# Altium schematic sheet IO.SchDoc: USB, microSD Card & Sensor Interface
size A4; DrawnBy: A. Küllenberg; Revision: A; SheetNumber: 10; SheetTotal: 10
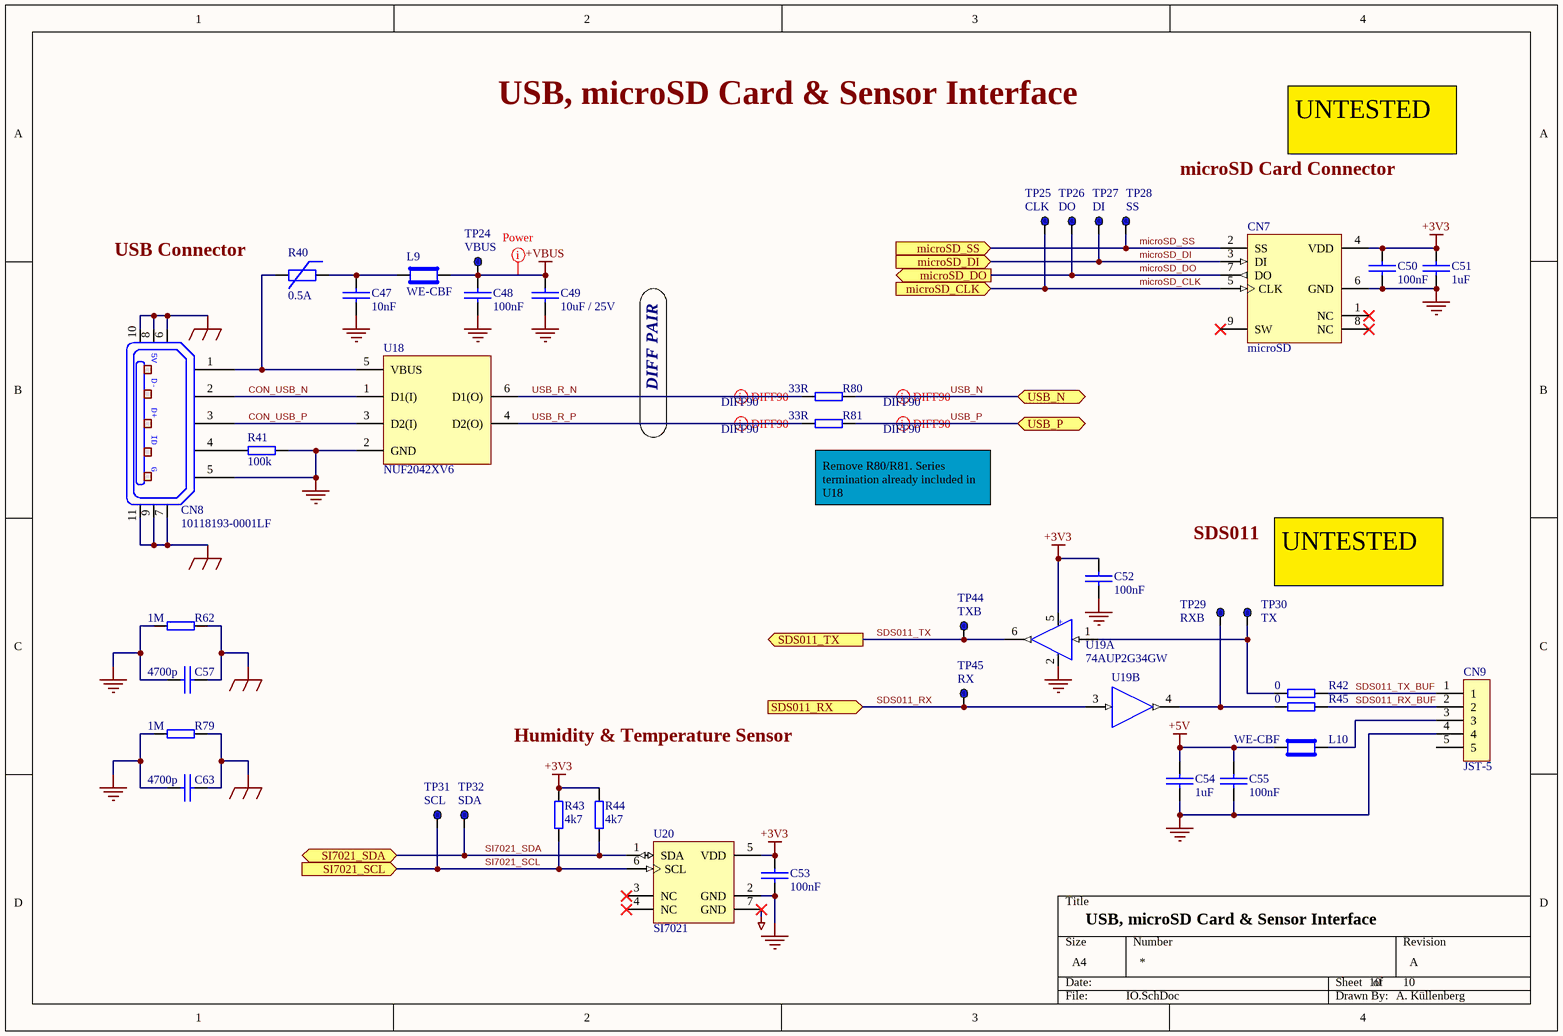
[diagram p0: IO.SchDoc]

## Parts
C47  10nF  [C0603]
C48  100nF  [C0603]
C49  10uF / 25V  [C0603]
C50  100nF  [C0603]
C51  1uF  [C0603]
C52  100nF  [C0603]
C53  100nF  [C0603]
C54  1uF  [C0603]
C55  100nF  [C0603]
C57  4700p  [C0805]
C63  4700p  [C0805]
CN7  microSD  [1050270001]
CN8  10118193-0001LF  [10118193]
CN9  JST-5  [JST-5]
L9  WE-CBF  [L0603]
L10  WE-CBF  [L0603]
R40  0.5A  [PTC-0603]
R41  100k  [R0603]
R42  0  [R0603]
R43  4k7  [R0603]
R44  4k7  [R0603]
R45  0  [R0603]
R62  1M  [R0805]
R79  1M  [R0805]
R80  33R  [R0402]
R81  33R  [R0402]
TP24  VBUS  [TP_1mm]  (no BOM)
TP25  CLK  [TP_1mm]  (no BOM)
TP26  DO  [TP_1mm]  (no BOM)
TP27  DI  [TP_1mm]  (no BOM)
TP28  SS  [TP_1mm]  (no BOM)
TP29  RXB  [TP_1mm]  (no BOM)
TP30  TX  [TP_1mm]  (no BOM)
TP31  SCL  [TP_1mm]  (no BOM)
TP32  SDA  [TP_1mm]  (no BOM)
TP44  TXB  [TP_1mm]  (no BOM)
TP45  RX  [TP_1mm]  (no BOM)
U18  NUF2042XV6  [SOT-563]
U19  74AUP2G34GW  [SOT363]  (parts A,B of 2)
U20  SI7021  [SI7021]

## Ports
microSD_CLK (in), microSD_DI (in), microSD_DO (out), microSD_SS (in), SDS011_RX (in), SDS011_TX (out), SI7021_SCL (in), SI7021_SDA (bidir), USB_N (bidir), USB_P (bidir)

## Nets
+3V3: C50.2 C51.2 C52.2 C53.2 CN7.4(VDD) R43.2 R44.2 U19.5 U20.5(VDD)
+5V: C54.1 C55.1 L10.1
+VBUS: C48.2 C49.2 L9.2 TP24.1
GND: C47.1 C48.1 C49.1 C50.1 C51.1 C52.1 C53.1 C54.2 C55.2 C57.1 C63.1 CN7.6(GND) CN8.5 CN9.4 R41.2 R62.1 R79.1 U18.2(GND) U19.2 U20.2(GND)
SHIELD: C57.2 C63.2 CN8.6 CN8.7 CN8.8 CN8.9 CN8.10 CN8.11 R62.2 R79.2
TH1: U20.7(GND)
CON_USB_N: CN8.2 U18.1(D1(I))
CON_USB_P: CN8.3 U18.3(D2(I))
microSD_CLK: CN7.5(CLK) TP25.1 ; port microSD_CLK
microSD_DI: CN7.3(DI) TP27.1 ; port microSD_DI
microSD_DO: CN7.7(DO) TP26.1 ; port microSD_DO
microSD_SS: CN7.2(SS) TP28.1 ; port microSD_SS
SDS011_RX: TP45.1 U19.3 ; port SDS011_RX
SDS011_RX_BUF: CN9.2 R45.2
SDS011_TX: TP44.1 U19.6 ; port SDS011_TX
SDS011_TX_BUF: CN9.1 R42.2
SI7021_SCL: R43.1 TP31.1 U20.6(SCL) ; port SI7021_SCL
SI7021_SDA: R44.1 TP32.1 U20.1(SDA) ; port SI7021_SDA
USB_N: R80.2 ; port USB_N
USB_P: R81.2 ; port USB_P
USB_R_N: R80.1 U18.6(D1(O))
USB_R_P: R81.1 U18.4(D2(O))
NetC47_2: C47.2 L9.1 R40.1
NetCN8_1: CN8.1 R40.2 U18.5(VBUS)
NetCN8_4: CN8.4 R41.1
NetCN9_3: CN9.3 L10.2
NetR42_1: R42.1 TP30.1 U19.1
NetR45_1: R45.1 TP29.1 U19.4

Not connected (* = marked no-connect by the designer): CN7 1(NC)* 8(NC)* 9(SW)*; CN9 5; U20 3(NC)* 4(NC)*

## Layout directives
differential pair; net class DIFF90: USB_N, USB_P, USB_R_N, USB_R_P
net class Power: +VBUS

## Notes on the sheet
- USB, microSD Card & Sensor Interface
- microSD Card Connector
- UNTESTED
- (near R40) USB Connector
- DIFF PAIR
- (near R81) Remove R80/R81. Series termination already included in U18
- SDS011
- Humidity & Temperature Sensor
- (in symbol 74AUP2G34GW,125, part A) +; -
- (in symbol 10118193-0001LF) 5V; D-; D+; ID; G

## Library data of the parts
C47 = 06035C103KAT2A: CAP CER 10000PF 50V X7R 0603; Manufacturer: AVX Corporation; Tolerance: ±10%; Part Number: 06035C103KAT2A; Value: 10nF; Supplier 1: Digi-Key; Supplier Part Number 1: 478-1227-1-ND; Manufacturer Part Number: 06035C103KAT2A; RoHS: RoHS Compliant; Category: Capacitors; Stock 1: 1245318; Pricing 1: 1=0.09, 10=0.017, 100=0.0079, 250=0.00644, 500=0.00552, 1000=0.0043 (EUR); Packaging: Cut Tape (CT); Capacitance: 10000pF; Voltage - Rated: 50V; Temperature Coefficient: X7R; Mounting Type: Surface Mount, MLCC; Operating Temperature: -55°C ~ 125°C; Applications: General Purpose; Ratings: -; Package / Case: 0603 (1608 Metric); Size / Dimension: 0.063" L x 0.032" W (1.60mm x 0.81mm); Height - Seated (Max): -; Thickness (Max): 0.035" (0.90mm); Lead Spacing: -; Features: -; Lead Style: -; ComponentLink1URL: http://datasheets.avx.com/X7RDielectric.pdf; ComponentLink1Description: http://datasheets.avx.com/X7RDielectric.pdf
C48 C50 C52 C53 C55 = C0603C104K5RACTU: CAP CER 0.1UF 50V X7R 0603; Manufacturer: Kemet; Capacitance: 0.10µF; Tolerance: ±10%; Part Number: C0603C104K5RACTU; Value: 100nF; Supplier 1: Digi-Key; Supplier Part Number 1: 399-5089-1-ND; Manufacturer Part Number: C0603C104K5RACTU; RoHS: RoHS Compliant; Category: Capacitors; Stock 1: 1628757; Pricing 1: 1=0.09, 10=0.037, 50=0.0198, 100=0.0167, 250=0.01372, 500=0.01174, 1000=0.00914 (EUR); Packaging: Cut Tape (CT); Voltage - Rated: 50V; Temperature Coefficient: X7R; Mounting Type: Surface Mount, MLCC; Operating Temperature: -55°C ~ 125°C; Applications: General Purpose; Ratings: -; Package / Case: 0603 (1608 Metric); Size / Dimension: 0.063" L x 0.031" W (1.60mm x 0.80mm); Height - Seated (Max): -; Thickness (Max): 0.034" (0.87mm); Lead Spacing: -; Features: -; Lead Style: -; ComponentLink1URL: http://www.kemet.com/docfinder?Partnumber=C0603C104K5RACTU; ComponentLink1Description: http://www.kemet.com/docfinder?Partnumber=C0603C104K5RACTU
C49 = ZRB18AR61E106ME01L: CAP CER 10UF 25V X5R 0603; Manufacturer: Murata Electronics North America; Capacitance: 10µF; Tolerance: ±20%; Part Number: ZRB18AR61E106ME01L; Value: 10uF / 25V; Supplier 1: Digi-Key; Supplier Part Number 1: 490-10991-1-ND; Manufacturer Part Number: ZRB18AR61E106ME01L; RoHS: RoHS Compliant; Category: Capacitors; Stock 1: 23575; Pricing 1: 1=0.4, 10=0.278, 25=0.2284, 50=0.195, 100=0.1671, 250=0.13924, 500=0.12532, 1000=0.10583 (EUR); Packaging: Cut Tape (CT); Voltage - Rated: 25V; Temperature Coefficient: X5R; Mounting Type: Surface Mount, MLCC; Operating Temperature: -55°C ~ 85°C; Applications: Acoustic Noise Reduction; Ratings: -; Package / Case: 0603 (1608 Metric); Size / Dimension: 0.063" L x 0.031" W (1.60mm x 0.80mm); Height - Seated (Max): -; Thickness (Max): 0.047" (1.20mm); Lead Spacing: -; Features: Interposer Termination; Lead Style: -; ComponentLink1URL: http://search.murata.co.jp/Ceramy/image/img/A01X/G101/ENG/ZRB18AR61E106ME01-01.pdf; ComponentLink1Description: http://search.murata.co.jp/Ceramy/image/img/A01X/G101/ENG/ZRB18AR61E106ME01-01.pdf; Part Status: Active
C51 C54 = GCM188R71E105KA64D: CAP CER 1UF 25V X7R 0603; Manufacturer: Murata Electronics North America; Capacitance: 1µF; Tolerance: ±10%; Part Number: GCM188R71E105KA64D; Value: 1uF; Supplier 1: Digi-Key; Supplier Part Number 1: 490-10673-1-ND; Manufacturer Part Number: GCM188R71E105KA64D; RoHS: RoHS Compliant; Category: Capacitors; Stock 1: 53908; Pricing 1: 1=0.19, 10=0.13, 50=0.0748, 100=0.0617, 250=0.05196, 500=0.04352, 1000=0.03572 (EUR); Packaging: Cut Tape (CT); Voltage - Rated: 25V; Temperature Coefficient: X7R; Mounting Type: Surface Mount, MLCC; Operating Temperature: -55°C ~ 125°C; Applications: Automotive; Ratings: AEC-Q200; Package / Case: 0603 (1608 Metric); Size / Dimension: 0.063" L x 0.031" W (1.60mm x 0.80mm); Height - Seated (Max): -; Thickness (Max): 0.035" (0.90mm); Lead Spacing: -; Features: -; Lead Style: -; ComponentLink1URL: http://www.murata.com/~/media/webrenewal/support/library/catalog/products/capacitor/mlcc/c03e.ashx; ComponentLink1Description: http://www.murata.com/~/media/webrenewal/support/library/catalog/products/capacitor/mlcc/c03e.ashx
C57 C63 = C0805V472KDRACTU: CAP CER 4700PF 1KV X7R 0805; Manufacturer: KEMET; Tolerance: ±10%; Voltage - Rated: 1000V (1kV); Part Number: C0805V472KDRACTU; Value: 4700p; Supplier 1: Digi-Key; Supplier Part Number 1: 399-6470-1-ND; Manufacturer Part Number: C0805V472KDRACTU; RoHS: RoHS Compliant; Category: Capacitors; Stock 1: 26470; Pricing 1: 1=0.21, 10=0.147, 100=0.0833, 500=0.0588, 1000=0.05145 (EUR); Packaging: Cut Tape (CT); Capacitance: 4700pF; Temperature Coefficient: X7R; Mounting Type: Surface Mount, MLCC; Operating Temperature: -55°C ~ 125°C; Applications: General Purpose; Ratings: -; Package / Case: 0805 (2012 Metric); Size / Dimension: 0.079" L x 0.049" W (2.00mm x 1.25mm); Height - Seated (Max): -; Thickness (Max): 0.055" (1.40mm); Lead Spacing: -; Features: High Voltage; Lead Style: -; ComponentLink1URL: http://www.kemet.com/docfinder?Partnumber=C0805V472KDRACTU; ComponentLink1Description: http://www.kemet.com/docfinder?Partnumber=C0805V472KDRACTU; Part Status: Active; Failure Rate: -
CN7 = 1050270001: CONN MICRO SD CARD PUSH-PULL R/A; Manufacturer: Molex, LLC; Connector Type: Connector; Number of Positions: 9 (8 + 1); Card Type: Secure Digital - microSD™; Insertion, Removal Method: Push In, Pull Out; Part Number: 1050270001; Value: microSD; Supplier 1: Digi-Key; Supplier Part Number 1: WM6825CT-ND; Manufacturer Part Number: 1050270001; RoHS: RoHS Compliant; Category: Connectors, Interconnects; Stock 1: 3139; Pricing 1: 1=1.38, 10=1.213, 25=1.1416, 50=1.094, 100=1.0465, 250=0.95136, 500=0.8562, 1000=0.76108 (EUR); Packaging: Cut Tape (CT); Mounting Type: Surface Mount, Right Angle; Features: Switch; Contact Finish: Gold; Contact Finish Thickness: Flash; ComponentLink1URL: http://www.molex.com/pdm_docs/sd/1050270001_sd.pdf; ComponentLink1Description: http://www.molex.com/pdm_docs/sd/1050270001_sd.pdf; Part Status: Active; Mounting Feature: Normal, Standard - Top; Ejector Side: -; Height Above Board: 0.067" (1.70mm)
CN8 = 10118193-0001LF: CONN USB MICRO B RECPT SMT R/A; Manufacturer: Amphenol FCI; Connector Type: USB - micro B; Number of Contacts: 5; Gender: Receptacle; Specifications: USB 2.0; Supplier 1: Digi-Key; Manufacturer Part Number: 10118193-0001LF; RoHS: RoHS Compliant; Category: Connectors, Interconnects; Stock 1: 3068; Pricing 1: 1=0.41, 10=0.393, 25=0.3372, 50=0.2862, 100=0.2751, 250=0.24704, 500=0.23582 (EUR); Packaging: Cut Tape (CT); Part Status: Active; Mounting Type: Surface Mount, Right Angle, Horizontal; Features: Shielded, Solder Retention; Ingress Protection: -; ComponentLink1URL: http://portal.fciconnect.com/Comergent//fci/drawing/10118193.pdf; ComponentLink1Description: http://portal.fciconnect.com/Comergent//fci/drawing/10118193.pdf; Supplier Part Number 1: 609-4616-1-ND
CN9 = B5B-XH-A(LF)(SN): CONN HEADER XH TOP 5POS 2.5MM; Manufacturer: JST Sales America Inc.; Number of Positions: 5; Number of Positions Loaded: All; Current Rating: 3A; Voltage Rating: 250V; Pitch - Mating: 0.098" (2.50mm); Shrouding: Shrouded - 4 Wall; Style: Board to Cable/Wire; Contact Length - Post: 0.134" (3.40mm); Material Flammability Rating: UL94 V-0; Mated Stacking Heights: 9.8mm; Part Number: B5B-XH-A(LF)(SN); Value: JST-5; Supplier 1: Digi-Key; Supplier Part Number 1: 455-2270-ND; Manufacturer Part Number: B5B-XH-A(LF)(SN); RoHS: RoHS Compliant; Category: Connectors, Interconnects; Stock 1: 53798; Pricing 1: 1=0.24, 10=0.224, 100=0.1552, 500=0.13134, 1000=0.10746, 5000=0.09552, 10000=0.08657 (EUR); Packaging: Bulk; Connector Type: Header; Contact Type: Male Pin; Number of Rows: 1; Mounting Type: Through Hole; Termination: Press-Fit, Solder; Fastening Type: Detent Lock; Features: -; ComponentLink1URL: http://www.jst-mfg.com/product/pdf/eng/eXH.pdf; ComponentLink1Description: http://www.jst-mfg.com/product/pdf/eng/eXH.pdf; Contact Material: Brass; Operating Temperature: -25°C ~ 85°C; Part Status: Active; Row Spacing - Mating: -; Contact Length - Mating: -; Contact Finish - Mating: Tin; Contact Finish Thickness - Mating: -; Insulation Color: Natural; Overall Contact Length: -; Insulation Height: 0.276" (7.00mm); Contact Shape: Square; Ingress Protection: -; Contact Finish - Post: Tin; Insulation Material: Polyamide (PA66), Nylon 6/6; Contact Finish Thickness - Post: -; Applications: -
L9 L10 = 742792651: FERRITE BEAD 600 OHM 0603 1LN; Manufacturer: Wurth Electronics Inc.; Filter Type: Signal Line; Number of Lines: 1; Impedance @ Frequency: 600 Ohm @ 100MHz; Current Rating (Max): 1A; DC Resistance (DCR) (Max): 200 mOhm; Part Number: 742792651; Value: WE-CBF; Supplier 1: Digi-Key; Supplier Part Number 1: 732-1593-1-ND; Manufacturer Part Number: 742792651; RoHS: RoHS Compliant; Category: Filters; Stock 1: 99870; Pricing 1: 1=0.22, 10=0.185, 50=0.1806, 100=0.1667, 1000=0.15164 (EUR); Packaging: Cut Tape (CT); Part Status: Active; Ratings: -; Operating Temperature: -55°C ~ 125°C; Package / Case: 0603 (1608 Metric); Mounting Type: Surface Mount; Height (Max): 0.039" (1.00mm); Size / Dimension: 0.063" L x 0.031" W (1.60mm x 0.80mm); ComponentLink1URL: http://katalog.we-online.de/pbs/datasheet/742792651.pdf; ComponentLink1Description: http://katalog.we-online.de/pbs/datasheet/742792651.pdf
R40 = MF-FSMF050X-2: FUSE PTC RESET 500MA SMD 0603; Manufacturer: Bourns Inc.; Voltage - Max: 6V; Current - Max: 40A; Time to Trip: 100ms; Resistance - Initial (Ri) (Min): 100 mOhm; Resistance - Post Trip (R1) (Max): 800 mOhm; Approvals: cURus, TUV; Part Number: MF-FSMF050X-2; Value: 0.5A; Supplier 1: Digi-Key; Supplier Part Number 1: MF-FSMF050X-2CT-ND; Manufacturer Part Number: MF-FSMF050X-2; RoHS: RoHS Compliant; Category: Circuit Protection; Stock 1: 19345; Pricing 1: 1=0.4, 5=0.394, 10=0.382, 50=0.321, 100=0.2666, 250=0.24232, 500=0.20598, 1000=0.18174 (EUR); Packaging: Cut Tape (CT); Mounting Type: Surface Mount; Package / Case: 0603 (1608 Metric), Concave; ComponentLink1URL: http://www.bourns.com/docs/Product-Datasheets/mffsmf.pdf; ComponentLink1Description: http://www.bourns.com/docs/Product-Datasheets/mffsmf.pdf; Part Status: Active; Operating Temperature: -40°C ~ 85°C; Type: Polymeric; Size / Dimension: 0.065" L x 0.033" W (1.65mm x 0.85mm); Height - Seated (Max): -; Thickness (Max): 0.039" (1.00mm); Lead Spacing: -; Resistance - 25°C (Typ): -; Ratings: -
R41 = RC0603FR-07100KL: RES SMD 100K OHM 1% 1/10W 0603; Manufacturer: Yageo; Power (Watts): 0.1W, 1/10W; Temperature Coefficient: ±100ppm/°C; Part Number: RC0603FR-07100KL; Value: 100k; Manufacturer Part Number: RC0603FR-07100KL; RoHS: RoHS Compliant; Category: Resistors; Stock 1: 6595647; Pricing 1: 1=0.09, 10=0.012, 25=0.0088, 50=0.007, 100=0.0051, 250=0.00388, 500=0.0031, 1000=0.00229 (EUR); Packaging: Cut Tape (CT); Resistance (Ohms): 100k; Tolerance: ±1%; Composition: Thick Film; Features: Moisture Resistant; Operating Temperature: -55°C ~ 155°C; Package / Case: 0603 (1608 Metric); Supplier Device Package: 0603; Size / Dimension: 0.063" L x 0.031" W (1.60mm x 0.80mm); ComponentLink1URL: http://www.yageo.com/documents/recent/PYu-RC_Group_51_RoHS_L_7.pdf; ComponentLink1Description: http://www.yageo.com/documents/recent/PYu-RC_Group_51_RoHS_L_7.pdf; Supplier 1: Digi-Key; Supplier Part Number 1: 311-100KHRCT-ND; Height - Seated (Max): 0.022" (0.55mm); Part Status: Active; Failure Rate: -
R42 R45 = RC0603JR-070RL: RES SMD 0.0OHM JUMPER 1/10W 0603; Manufacturer: Yageo; Resistance (Ohms): 0.0; Power (Watts): 0.1W, 1/10W; Part Number: RC0603JR-070RL; Value: 0; Manufacturer Part Number: RC0603JR-070RL; RoHS: RoHS Compliant; Category: Resistors; Stock 1: 12194512; Pricing 1: 1=0.09, 10=0.009, 25=0.0072, 50=0.0052, 100=0.0039, 250=0.003, 500=0.0024, 1000=0.00176 (EUR); Packaging: Cut Tape (CT); Tolerance: Jumper; Composition: Thick Film; Features: Moisture Resistant; Temperature Coefficient: -; Operating Temperature: -55°C ~ 155°C; Package / Case: 0603 (1608 Metric); Supplier Device Package: 0603; Size / Dimension: 0.063" L x 0.031" W (1.60mm x 0.80mm); ComponentLink1URL: http://www.yageo.com/documents/recent/PYu-RC_Group_51_RoHS_L_7.pdf; ComponentLink1Description: http://www.yageo.com/documents/recent/PYu-RC_Group_51_RoHS_L_7.pdf; Supplier 1: Digi-Key; Supplier Part Number 1: 311-0.0GRCT-ND; Height - Seated (Max): 0.022" (0.55mm); Part Status: Active; Failure Rate: -
R43 R44 = CRCW06034K70FKEA: RES SMD 4.7K OHM 1% 1/10W 0603; Manufacturer: Vishay Dale; Power (Watts): 0.1W, 1/10W; Temperature Coefficient: ±100ppm/°C; Part Number: CRCW06034K70FKEA; Value: 4k7; Manufacturer Part Number: CRCW06034K70FKEA; RoHS: RoHS Compliant; Category: Resistors; Stock 1: 324271; Pricing 1: 1=0.09, 10=0.027, 25=0.0196, 50=0.015, 100=0.011, 250=0.0084, 500=0.00674, 1000=0.00496, 2500=0.00431 (EUR); Packaging: Cut Tape (CT); Resistance (Ohms): 4.7k; Tolerance: ±1%; Composition: Thick Film; Features: Automotive AEC-Q200; Operating Temperature: -55°C ~ 155°C; Package / Case: 0603 (1608 Metric); Supplier Device Package: 0603; Size / Dimension: 0.061" L x 0.033" W (1.55mm x 0.85mm); Height: 0.020" (0.50mm); Number of Terminations: 2; ComponentLink1URL: http://www.vishay.com/docs/20035/dcrcwe3.pdf; ComponentLink1Description: http://www.vishay.com/docs/20035/dcrcwe3.pdf; Supplier 1: Digi-Key; Supplier Part Number 1: 541-4.70KHCT-ND
R62 R79 = RV0805FR-071ML: RES SMD 1M OHM 1% 1/8W 0805; Manufacturer: Yageo; Power (Watts): 0.125W, 1/8W; Temperature Coefficient: ±200ppm/°C; Part Number: RV0805FR-071ML; Value: 1M; Manufacturer Part Number: RV0805FR-071ML; RoHS: RoHS Compliant; Category: Resistors; Stock 1: 63; Pricing 1: 1=0.39, 10=0.297, 100=0.1249, 1000=0.0689, 2500=0.0646 (EUR); Packaging: Cut Tape (CT); Resistance (Ohms): 1M; Tolerance: ±1%; Composition: Thick Film; Features: High Voltage, Moisture Resistant; Operating Temperature: -55°C ~ 155°C; Package / Case: 0805 (2012 Metric); Supplier Device Package: 0805; Size / Dimension: 0.079" L x 0.049" W (2.00mm x 1.25mm); ComponentLink1URL: http://www.yageo.com/documents/recent/PYu-RV_51_RoHS_L_6.pdf; ComponentLink1Description: http://www.yageo.com/documents/recent/PYu-RV_51_RoHS_L_6.pdf; Supplier 1: Digi-Key; Supplier Part Number 1: 311-1MNGCT-ND; Height - Seated (Max): 0.024" (0.60mm); Part Status: Active; Failure Rate: -
R80 R81 = RC0402FR-0733RL: RES SMD 33 OHM 1% 1/16W 0402; Manufacturer: Yageo; Resistance (Ohms): 33; Power (Watts): 0.063W, 1/16W; Temperature Coefficient: ±100ppm/°C; Part Number: RC0402FR-0733RL; Value: 33R; Manufacturer Part Number: RC0402FR-0733RL; RoHS: RoHS Compliant; Category: Resistors; Stock 1: 1076015; Pricing 1: 1=0.09, 10=0.012, 100=0.005, 1000=0.00222, 2500=0.00193, 5000=0.00159 (EUR); Packaging: Cut Tape (CT); Tolerance: ±1%; Composition: Thick Film; Features: Moisture Resistant; Operating Temperature: -55°C ~ 155°C; Package / Case: 0402 (1005 Metric); Supplier Device Package: 0402; Size / Dimension: 0.039" L x 0.020" W (1.00mm x 0.50mm); ComponentLink1URL: http://www.yageo.com/documents/recent/PYu-RC_Group_51_RoHS_L_7.pdf; ComponentLink1Description: http://www.yageo.com/documents/recent/PYu-RC_Group_51_RoHS_L_7.pdf; Supplier 1: Digi-Key; Supplier Part Number 1: 311-33.0LRCT-ND; Height - Seated (Max): 0.016" (0.40mm); Part Status: Active; Failure Rate: -
TP24-TP32 TP44 TP45 = TP: Value: TP; Part Number: TP
U18 = NUF2042XV6T1G: FILTER RC(PI) 22 OHM/42PF SMD; Manufacturer: ON Semiconductor; Filter Order: 2nd; Number of Channels: 3; Resistance - Channel (Ohms): 22; Values: R = 22 Ohms, C = 42pF (Total); ESD Protection: Yes; Part Number: NUF2042XV6T1G; Value: NUF2042XV6; Supplier 1: Digi-Key; Supplier Part Number 1: NUF2042XV6T1GOSCT-ND; Manufacturer Part Number: NUF2042XV6T1G; RoHS: RoHS Compliant; Category: Filters; Stock 1: 5434; Pricing 1: 1=0.29, 10=0.27, 25=0.2576, 50=0.2492, 100=0.2409, 250=0.22844, 500=0.19106, 1000=0.14828 (EUR); Packaging: Cut Tape (CT); Operating Temperature: -55°C ~ 125°C; Mounting Type: Surface Mount; Package / Case: SOT-563, SOT-666; ComponentLink1URL: http://www.onsemi.com/pub_link/Collateral/NUF2030XV6-D.PDF; ComponentLink1Description: http://www.onsemi.com/pub_link/Collateral/NUF2030XV6-D.PDF; Type: Low Pass; Applications: USB; Part Status: Active; Size / Dimension: 0.063" L x 0.047" W (1.60mm x 1.20mm); Technology: RC (Pi); Center / Cutoff Frequency: -; Attenuation Value: -; Current: -; Voltage - Rated: -; Height: 0.024" (0.60mm)
U19 = 74AUP2G34GW,125: IC BUFF DL LOW PWR N-INV 6TSSOP; Manufacturer: Nexperia USA Inc.; Logic Type: Buffer, Non-Inverting; Number of Bits per Element: 1; Part Number: 74AUP2G34GW,125; Value: 74AUP2G34GW; Supplier 1: Digi-Key; Supplier Part Number 1: 1727-3208-1-ND; Manufacturer Part Number: 74AUP2G34GW,125; RoHS: RoHS Compliant; Category: Integrated Circuits (ICs); Stock 1: 4222; Pricing 1: 1=0.44, 10=0.376, 100=0.2804, 500=0.2203, 1000=0.17023 (EUR); Packaging: Cut Tape (CT); Part Status: Active
U20 = SI7021-A20-GM1: SENS HUMI/TEMP 3.6V I2C 3% 6DFN; Manufacturer: Silicon Labs; Voltage - Supply: 1.9 V ~ 3.6 V; Output Type: I²C; Sensor Type: Humidity, Temperature; Humidity Range: 0 ~ 100% RH; Output: 12b; Accuracy: ±3% RH; Response Time: 18S; Part Number: SI7021-A20-GM1; Value: SI7021; Supplier 1: Digi-Key; Supplier Part Number 1: 336-3141-ND; Manufacturer Part Number: SI7021-A20-GM1; RoHS: RoHS Compliant; Category: Sensors, Transducers; Stock 1: 1678; Pricing 1: 1=3.21, 25=3.0892, 100=2.9747, 1000=2.84126 (EUR); Packaging: Cut Tape (CT); Operating Temperature: -40°C ~ 85°C; ComponentLink1URL: https://www.silabs.com/Support%20Documents/TechnicalDocs/Si7021-A20.pdf; ComponentLink1Description: https://www.silabs.com/Support%20Documents/TechnicalDocs/Si7021-A20.pdf; Part Status: Active; Sensitivity: -; Mounting Type: Surface Mount